# Altium schematic sheet MCU.SchDoc
size B
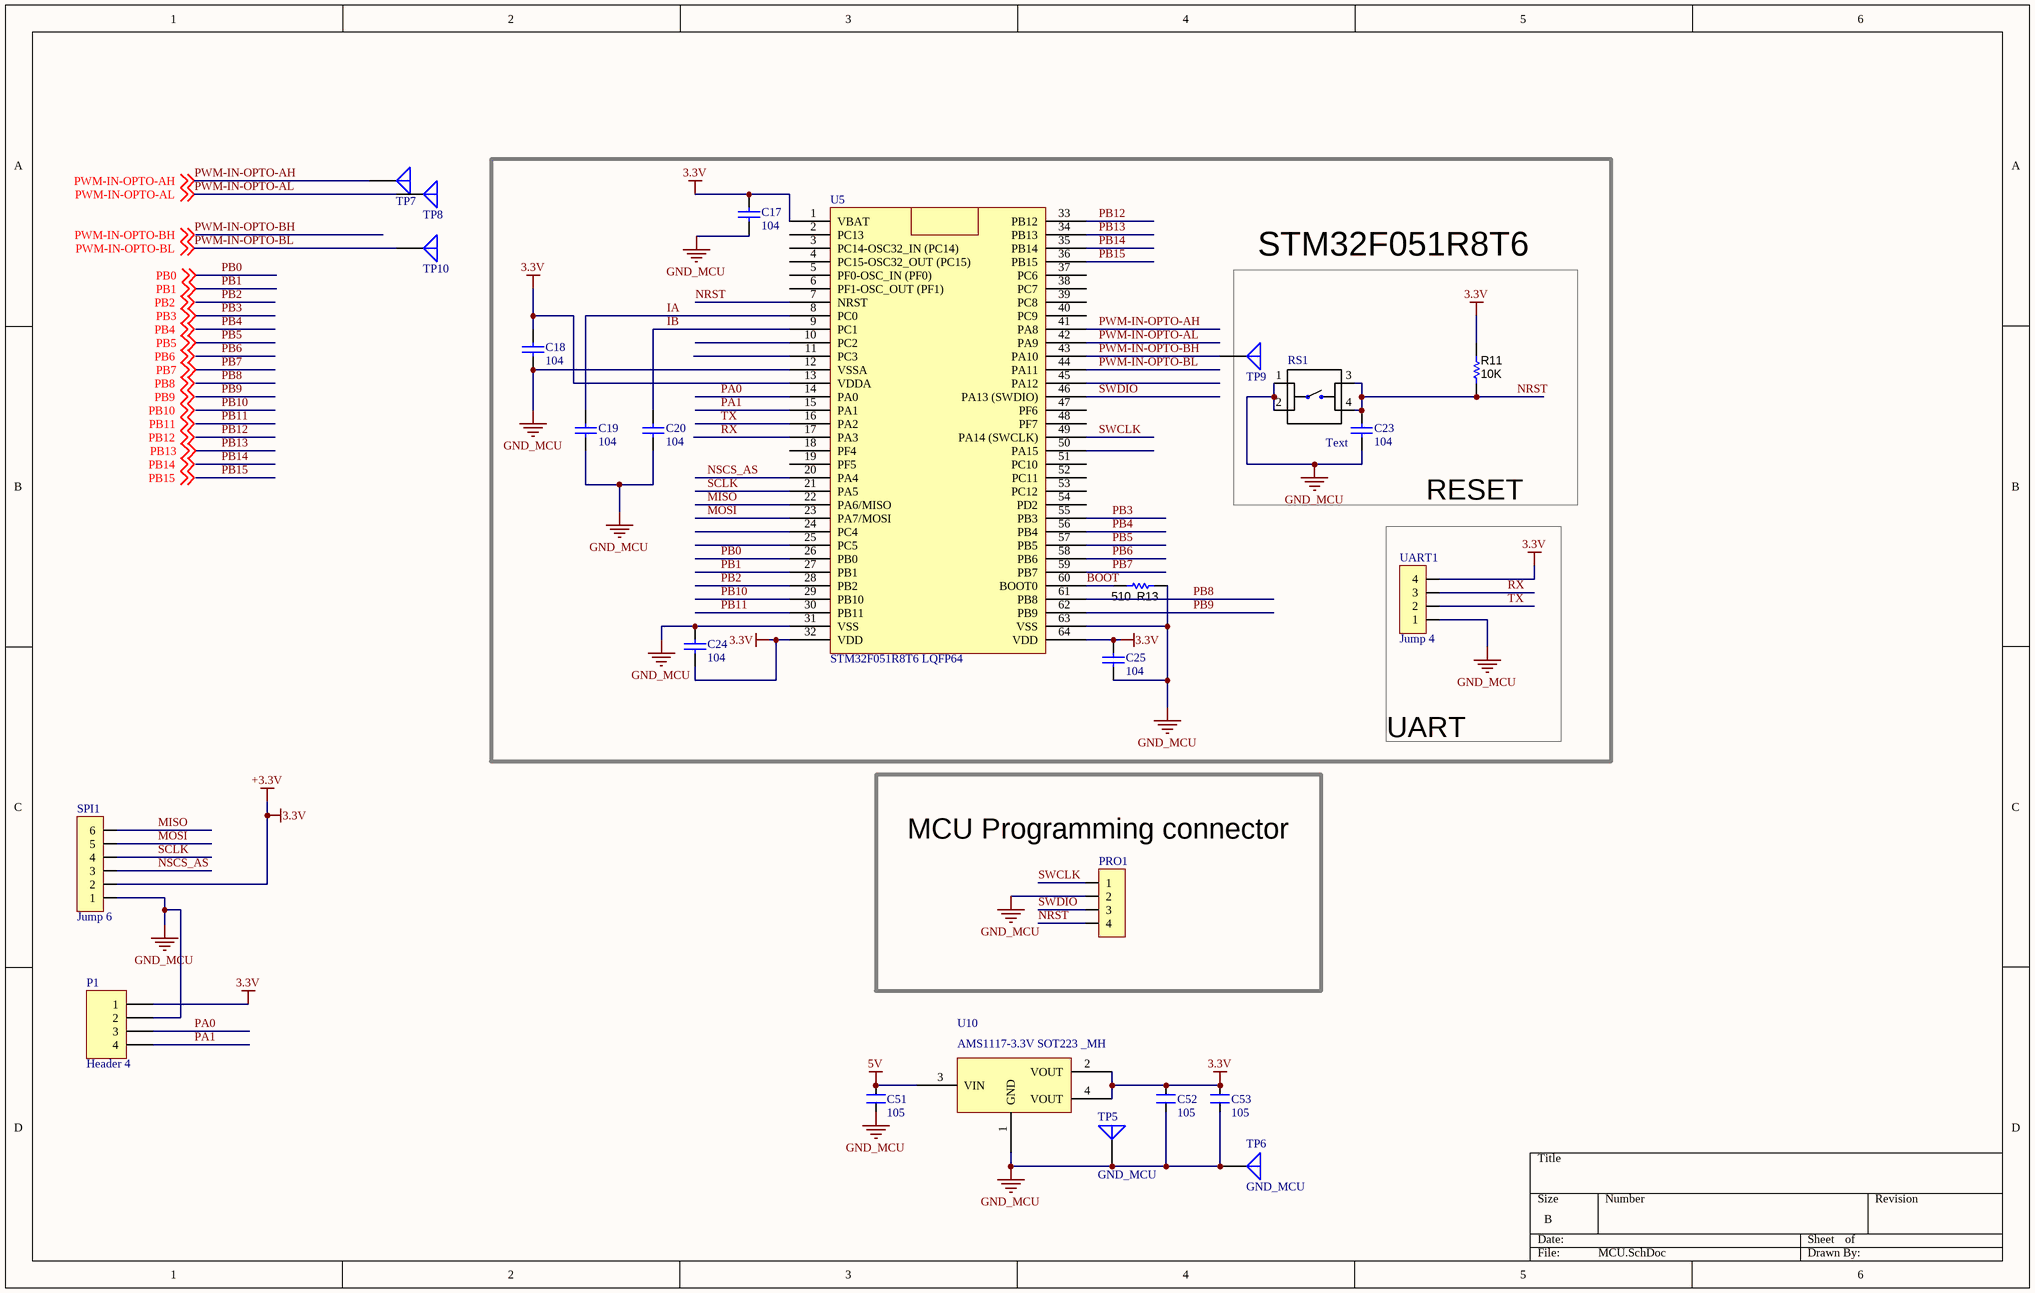
[diagram p0: MCU.SchDoc]

## Parts
C17  104  [0603_Cap]
C18  104  [0805_hv]
C19  104  [TU_SMD_0805]
C20  104  [TU_SMD_0805]
C23  104  [0603_Cap]
C24  104  [0805_hv]
C25  104  [0805_hv]
C51  105  [0805_HV]
C52  105  [0805_HV]
C53  105  [0805_HV]
P1  Header 4  [HDR1X4]
PRO1  Jump 4_MH  [Jump 4]  (value not drawn)
R11  10K  [0603_R]
R13  510  [0603_R]
RS1  *  [SMD Button 6X6]  (value not drawn)
SPI1  Jump 6  [ZH 1.5 6P]
TP5  GND_MCU  [PIN1]
TP6  GND_MCU  [PIN1]
TP7  PW1  [PIN1]  (value not drawn)
TP8  PW1  [PIN1]  (value not drawn)
TP9  PW  [PIN1]  (value not drawn)
TP10  PW1  [PIN1]  (value not drawn)
U5  STM32F051R8T6 LQFP64  [LQFP64]
U10  AMS1117-3.3V SOT223 _MH  [SOT223]
UART1  Jump 4  [HEADER 4]

## Blocks framed on the sheet
STM32F051R8T6: C17-C20 C24 C25 R13 U5
RESET: C23 R11 RS1 TP9
UART: UART1
MCU Programming connector: PRO1

## Nets
5V: C51.2 U10.3(VIN)
+3.3V: C17.2 C18.2 C24.1 C25.2 C52.2 C53.2 P1.1 R11.2 SPI1.2 U5.1(VBAT) U5.13(VDDA) U5.32(VDD) U5.64(VDD) U10.2(VOUT) U10.4(VOUT) UART1.4  [also labelled 3.3V]
GND_MCU: C17.1 C18.1 C19.1 C20.1 C23.1 C24.2 C25.1 C51.1 C52.1 C53.1 P1.2 PRO1.2 R13.1 RS1.1 RS1.2 SPI1.1 TP5.1(A) TP6.1(A) U5.12(VSSA) U5.31(VSS) U5.63(VSS) U10.1(GND) UART1.1
BOOT: R13.2 U5.60(BOOT0)
IA: C19.2 U5.8(PC0)
IB: C20.2 U5.9(PC1)
MISO: SPI1.6 U5.22(PA6/MISO)
MOSI: SPI1.5 U5.23(PA7/MOSI)
NRST: C23.2 PRO1.4 R11.1 RS1.3 RS1.4 U5.7(NRST)
NSCS_AS: SPI1.3 U5.20(PA4)
PA0: P1.3 U5.14(PA0)
PA1: P1.4 U5.15(PA1)
PB0: U5.26(PB0) ; off-sheet PB0
PB1: U5.27(PB1) ; off-sheet PB1
PB2: U5.28(PB2) ; off-sheet PB2
PB3: U5.55(PB3) ; off-sheet PB3
PB4: U5.56(PB4) ; off-sheet PB4
PB5: U5.57(PB5) ; off-sheet PB5
PB6: U5.58(PB6) ; off-sheet PB6
PB7: U5.59(PB7) ; off-sheet PB7
PB8: U5.61(PB8) ; off-sheet PB8
PB9: U5.62(PB9) ; off-sheet PB9
PB10: U5.29(PB10) ; off-sheet PB10
PB11: U5.30(PB11) ; off-sheet PB11
PB12: U5.33(PB12) ; off-sheet PB12
PB13: U5.34(PB13) ; off-sheet PB13
PB14: U5.35(PB14) ; off-sheet PB14
PB15: U5.36(PB15) ; off-sheet PB15
PWM-IN-OPTO-AH: TP7.1(A) U5.41(PA8) ; off-sheet PWM-IN-OPTO-AH
PWM-IN-OPTO-AL: TP8.1(A) U5.42(PA9) ; off-sheet PWM-IN-OPTO-AL
PWM-IN-OPTO-BH: TP9.1(A) U5.43(PA10) ; off-sheet PWM-IN-OPTO-BH
PWM-IN-OPTO-BL: TP10.1(A) U5.44(PA11) ; off-sheet PWM-IN-OPTO-BL
RX: U5.17(PA3) UART1.3
SCLK: SPI1.4 U5.21(PA5)
SWCLK: PRO1.1 U5.49(PA14_(SWCLK))
SWDIO: PRO1.3 U5.46(PA13_(SWDIO))
TX: U5.16(PA2) UART1.2

Not connected (* = marked no-connect by the designer): U5 2(PC13) 3(PC14-OSC32_IN_(PC14)) 4(PC15-OSC32_OUT_(PC15)) 5(PF0-OSC_IN_(PF0)) 6(PF1-OSC_OUT_(PF1)) 10(PC2) 11(PC3) 18(PF4) 19(PF5) 24(PC4) 25(PC5) 37(PC6) 38(PC7) 39(PC8) 40(PC9) 45(PA12) 47(PF6) 48(PF7) 50(PA15) 51(PC10) 52(PC11) 53(PC12) 54(PD2)

## Notes on the sheet
- (near C23) Text
- Labels drawn without touching a wire or pin: PB2, PB4, PB6, PB8, PB9, PB10, PB11, PB12, PB14, PB15

## Library data of the parts
C17-C20 C23-C25 = Capacitor 0805: Ceramic Chip Capacitor - Standard; Note: Footprint corresponds to dimensions for bulk cassette packaging. This case size has tightened tolerances.; Published: 17-Jul-2002; LatestRevisionDate: 19-Mar-2004; LatestRevisionNote: Silkscreen size reduced.; DatasheetDocument: Mar-2001; PackageDocument: Mar-2001; PackageReference: 0805; Publisher: Altium Limited; Code_JEITA: 0805; Code_IPC: 2012[0805]; ComponentLink1Description: Manufacturer Link; ComponentLink1URL: http://www.kemet.com/; ComponentLink2Description: Datasheet; ComponentLink2URL: http://www.kemet.com/kemet/web/homepage/kechome.nsf/vapubfilesname/F3102TA.pdf/$file/F3102TA.pdf; Value: 104
C51-C53 = CM: Cap SMD; Value: 103
P1 = Header 4: Header, 4-Pin; LatestRevisionDate: 17-Jul-2002; LatestRevisionNote: Re-released for DXP Platform.; Publisher: Altium Limited
PRO1 = Jump 4_MH: Jump 4P 2.54
R11 R13 = R nho: RES, 100, 1%, 0.1 W, 0402; PartNumber: ERJ-2RKF1000X; Manufacturer: Panasonic; CompType: Resistor; Res_ohm: 100; Value_Code: 100R; Tolerance_%: 1; Power_W: 0.1; Value2: 0.1W; VDC_V: 50; TempCo: 100 ppm/C; EIA_Code: E96; U/M: EA; AEC Category: Q200; SymbolVersion: 2009-05-29; PackageReference: 0402; RoHS: Y; Value1: 1%; MountType: SMT; Technology: Thick Film; Published: 2008-06-26; Publisher: Texas Instruments; LatestRevisionDate: 2016-01-08; ComponentLink1Description: Datasheet link; ComponentLink1URL: http://industrial.panasonic.com/www-data/pdf/AOA0000/AOA0000CE2.pdf; Supplier 1: Digi-Key; Supplier Part Number 1: P100LCT-ND; Supplier 2: Mouser; Supplier Part Number 2: 667-ERJ-2RKF1000X; Supplier 3: Farnell; Supplier Part Number 3: 2304034; AEC Qualified: ?
  R11: Value: 10K
  R13: Value: 510
RS1 = SMD Button 6X6: FSM4JSMA=SMT,TACTILE,PB SWITCH; Configuration_Pole-Throw: Single Pole - Single Throw; MP: 4-1437565-1; MF: TE Connectivity; Contact_Current_Rating: 50 mA; Availability: Good; Price: 0.15 USD; Package: None; Link: http://www.te.com/usa-en/product-4-1437565-1.html; EU_RoHS_Compliance: Compliant; SnapEDA_Link: https://www.snapeda.com/parts/4-1437565-1/TE%20Connectivity/view-part/?ref=snap; Value: *; Supplier 1: Digi-Key; Supplier Part Number 1: 450-1759-2-ND
SPI1 = Jump 6: Jump 6P 2.54
TP5-TP10 = Antenna: Generic Antenna; Published: 24-Mar-1999; LatestRevisionDate: 17-Jul-2002; LatestRevisionNote: Re-released for DXP Platform.; PackageReference: PIN1; Publisher: Altium Limited
U5 = STM32F051R8T6 LQFP64 _MH
UART1 = Jump 4: Jump 4P 2.54